# EasyEDA Pro project CALU_BMS_1_2_0_0.epro, schematic Slave BMS

## Sheets
1 P1: Board Name: Slave; Create Date: 2025-08-16; Page Name: P1; Project Name: CALU_BMS; Schematic Name: Slave BMS; Update Date: 2025-09-30; Company: EasyEDA.com; Page Size: A4; Version: V1.0
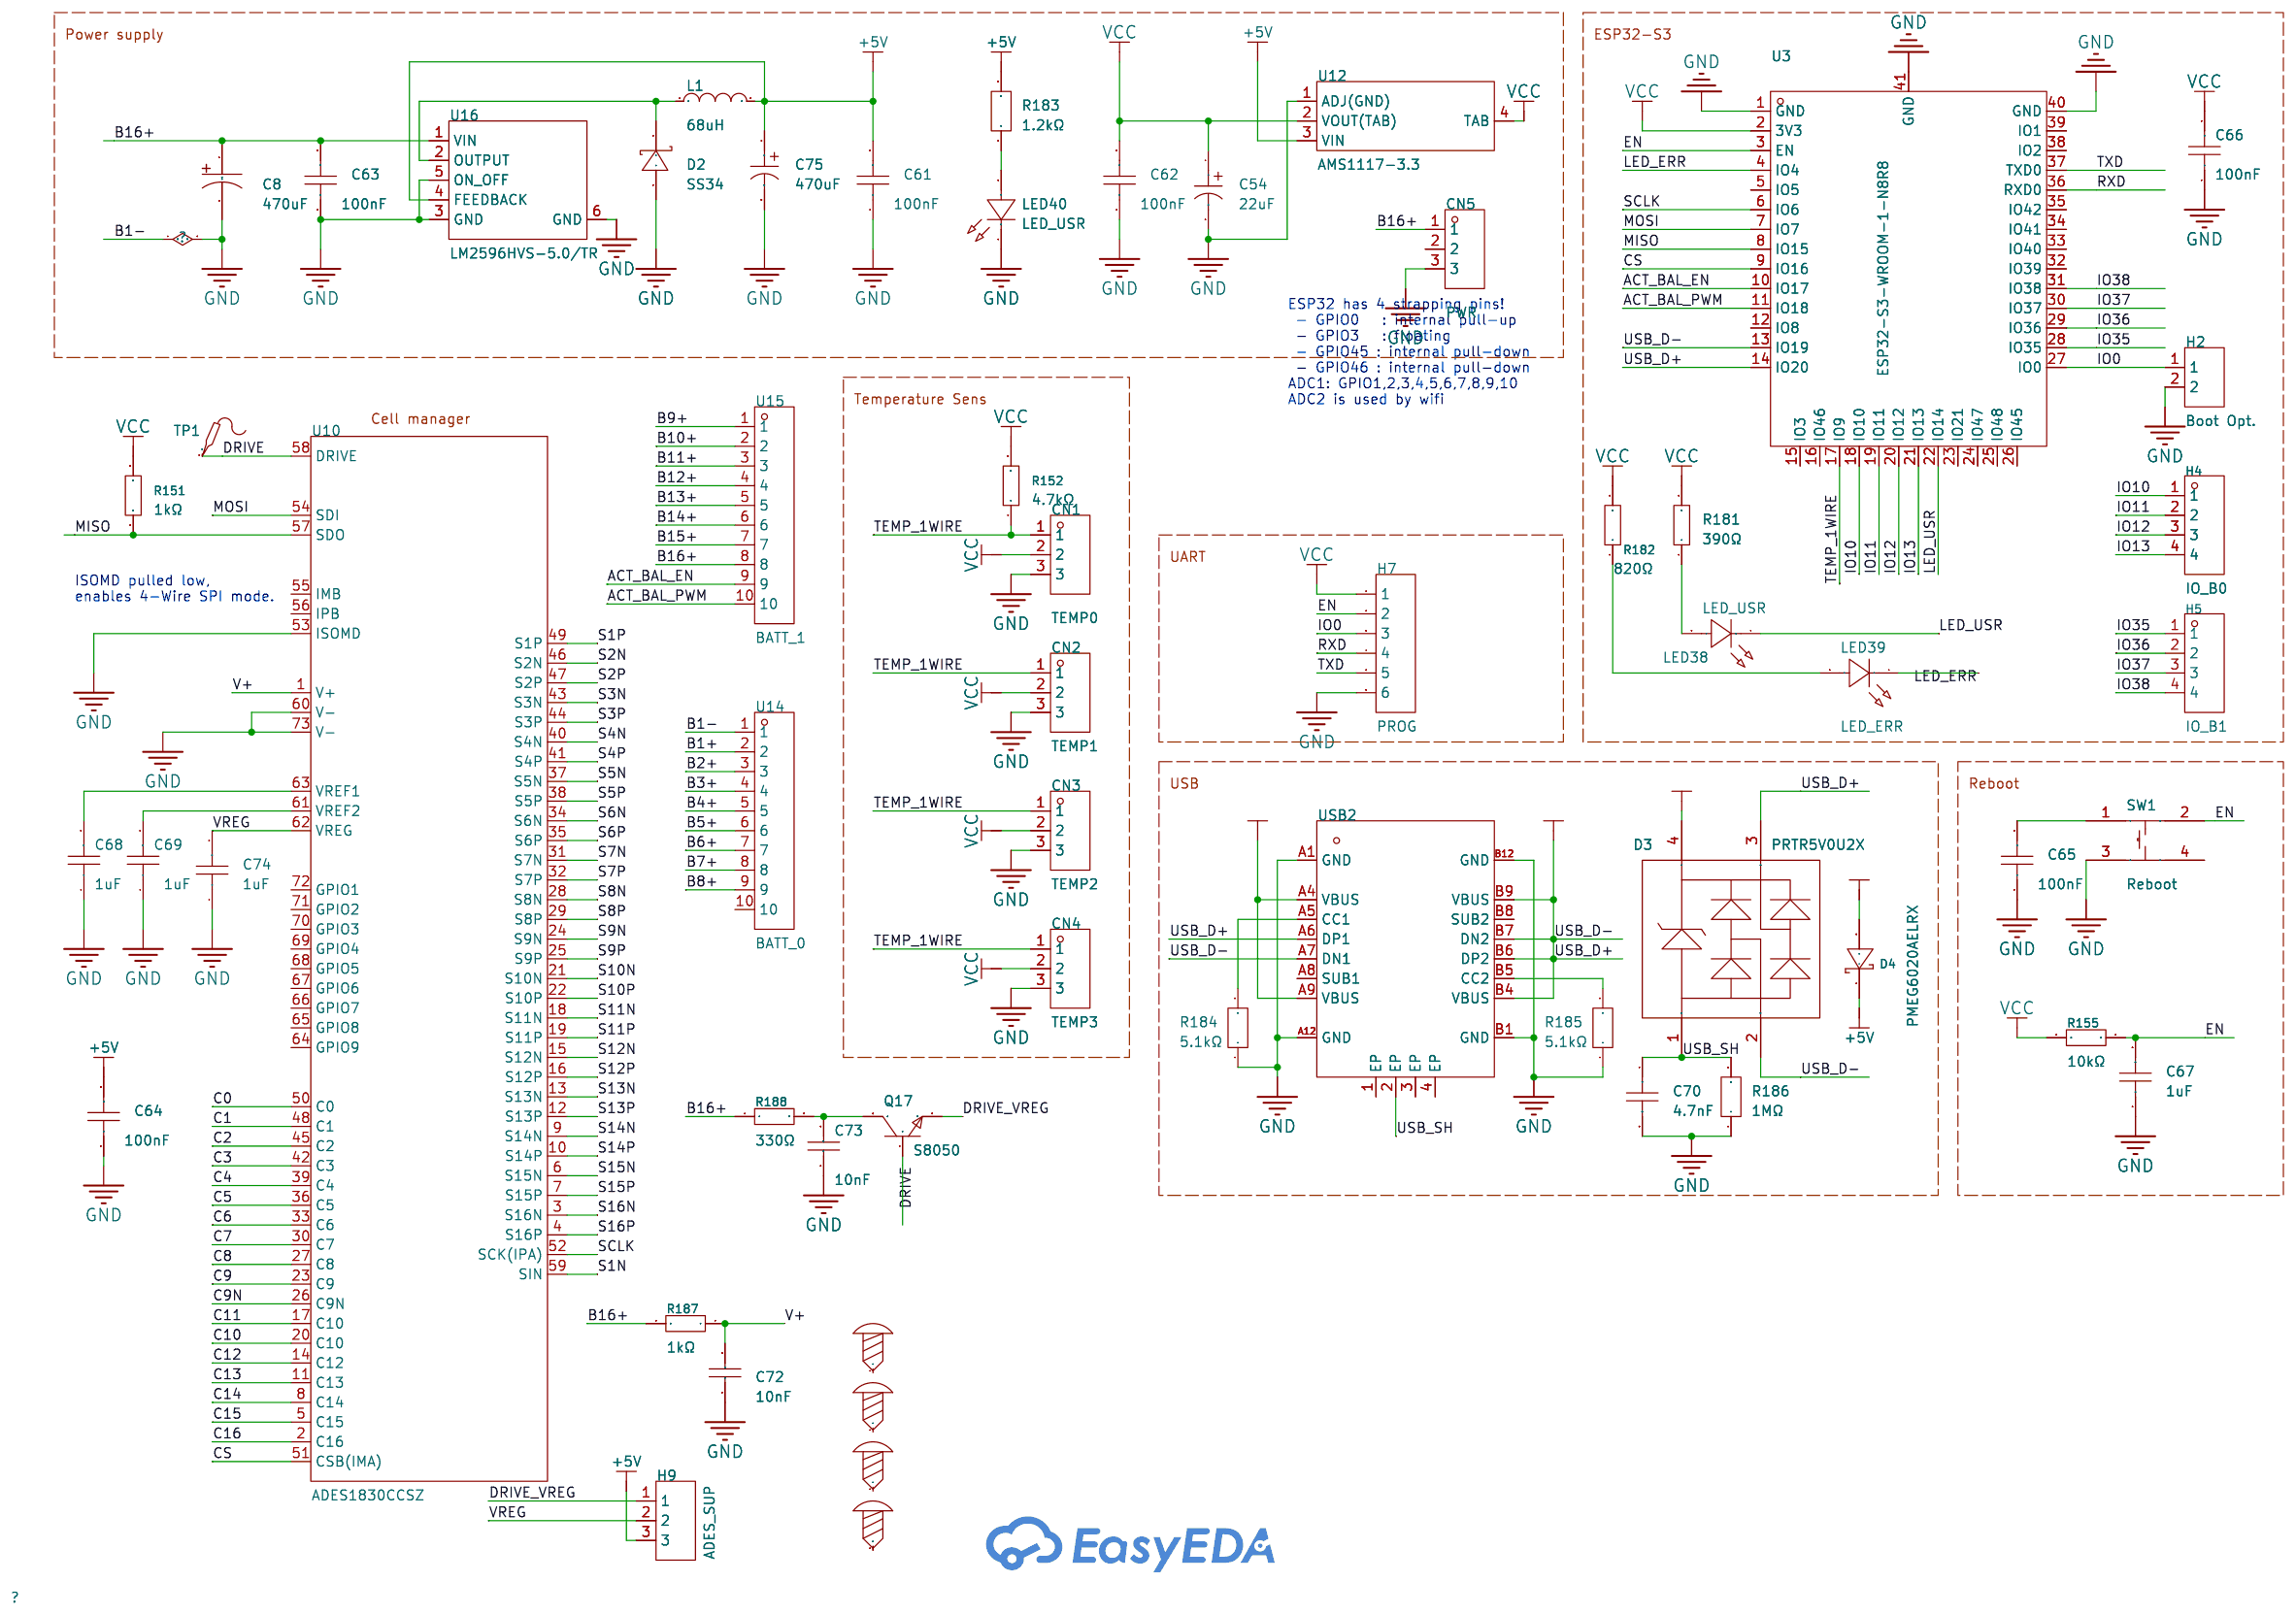
[diagram p1: P1]
2 P2: Create Date: 2025-08-28; Page Name: P2; Project Name: Active Balancer splitter; Schematic Name: Schematic2; Update Date: 2025-09-05
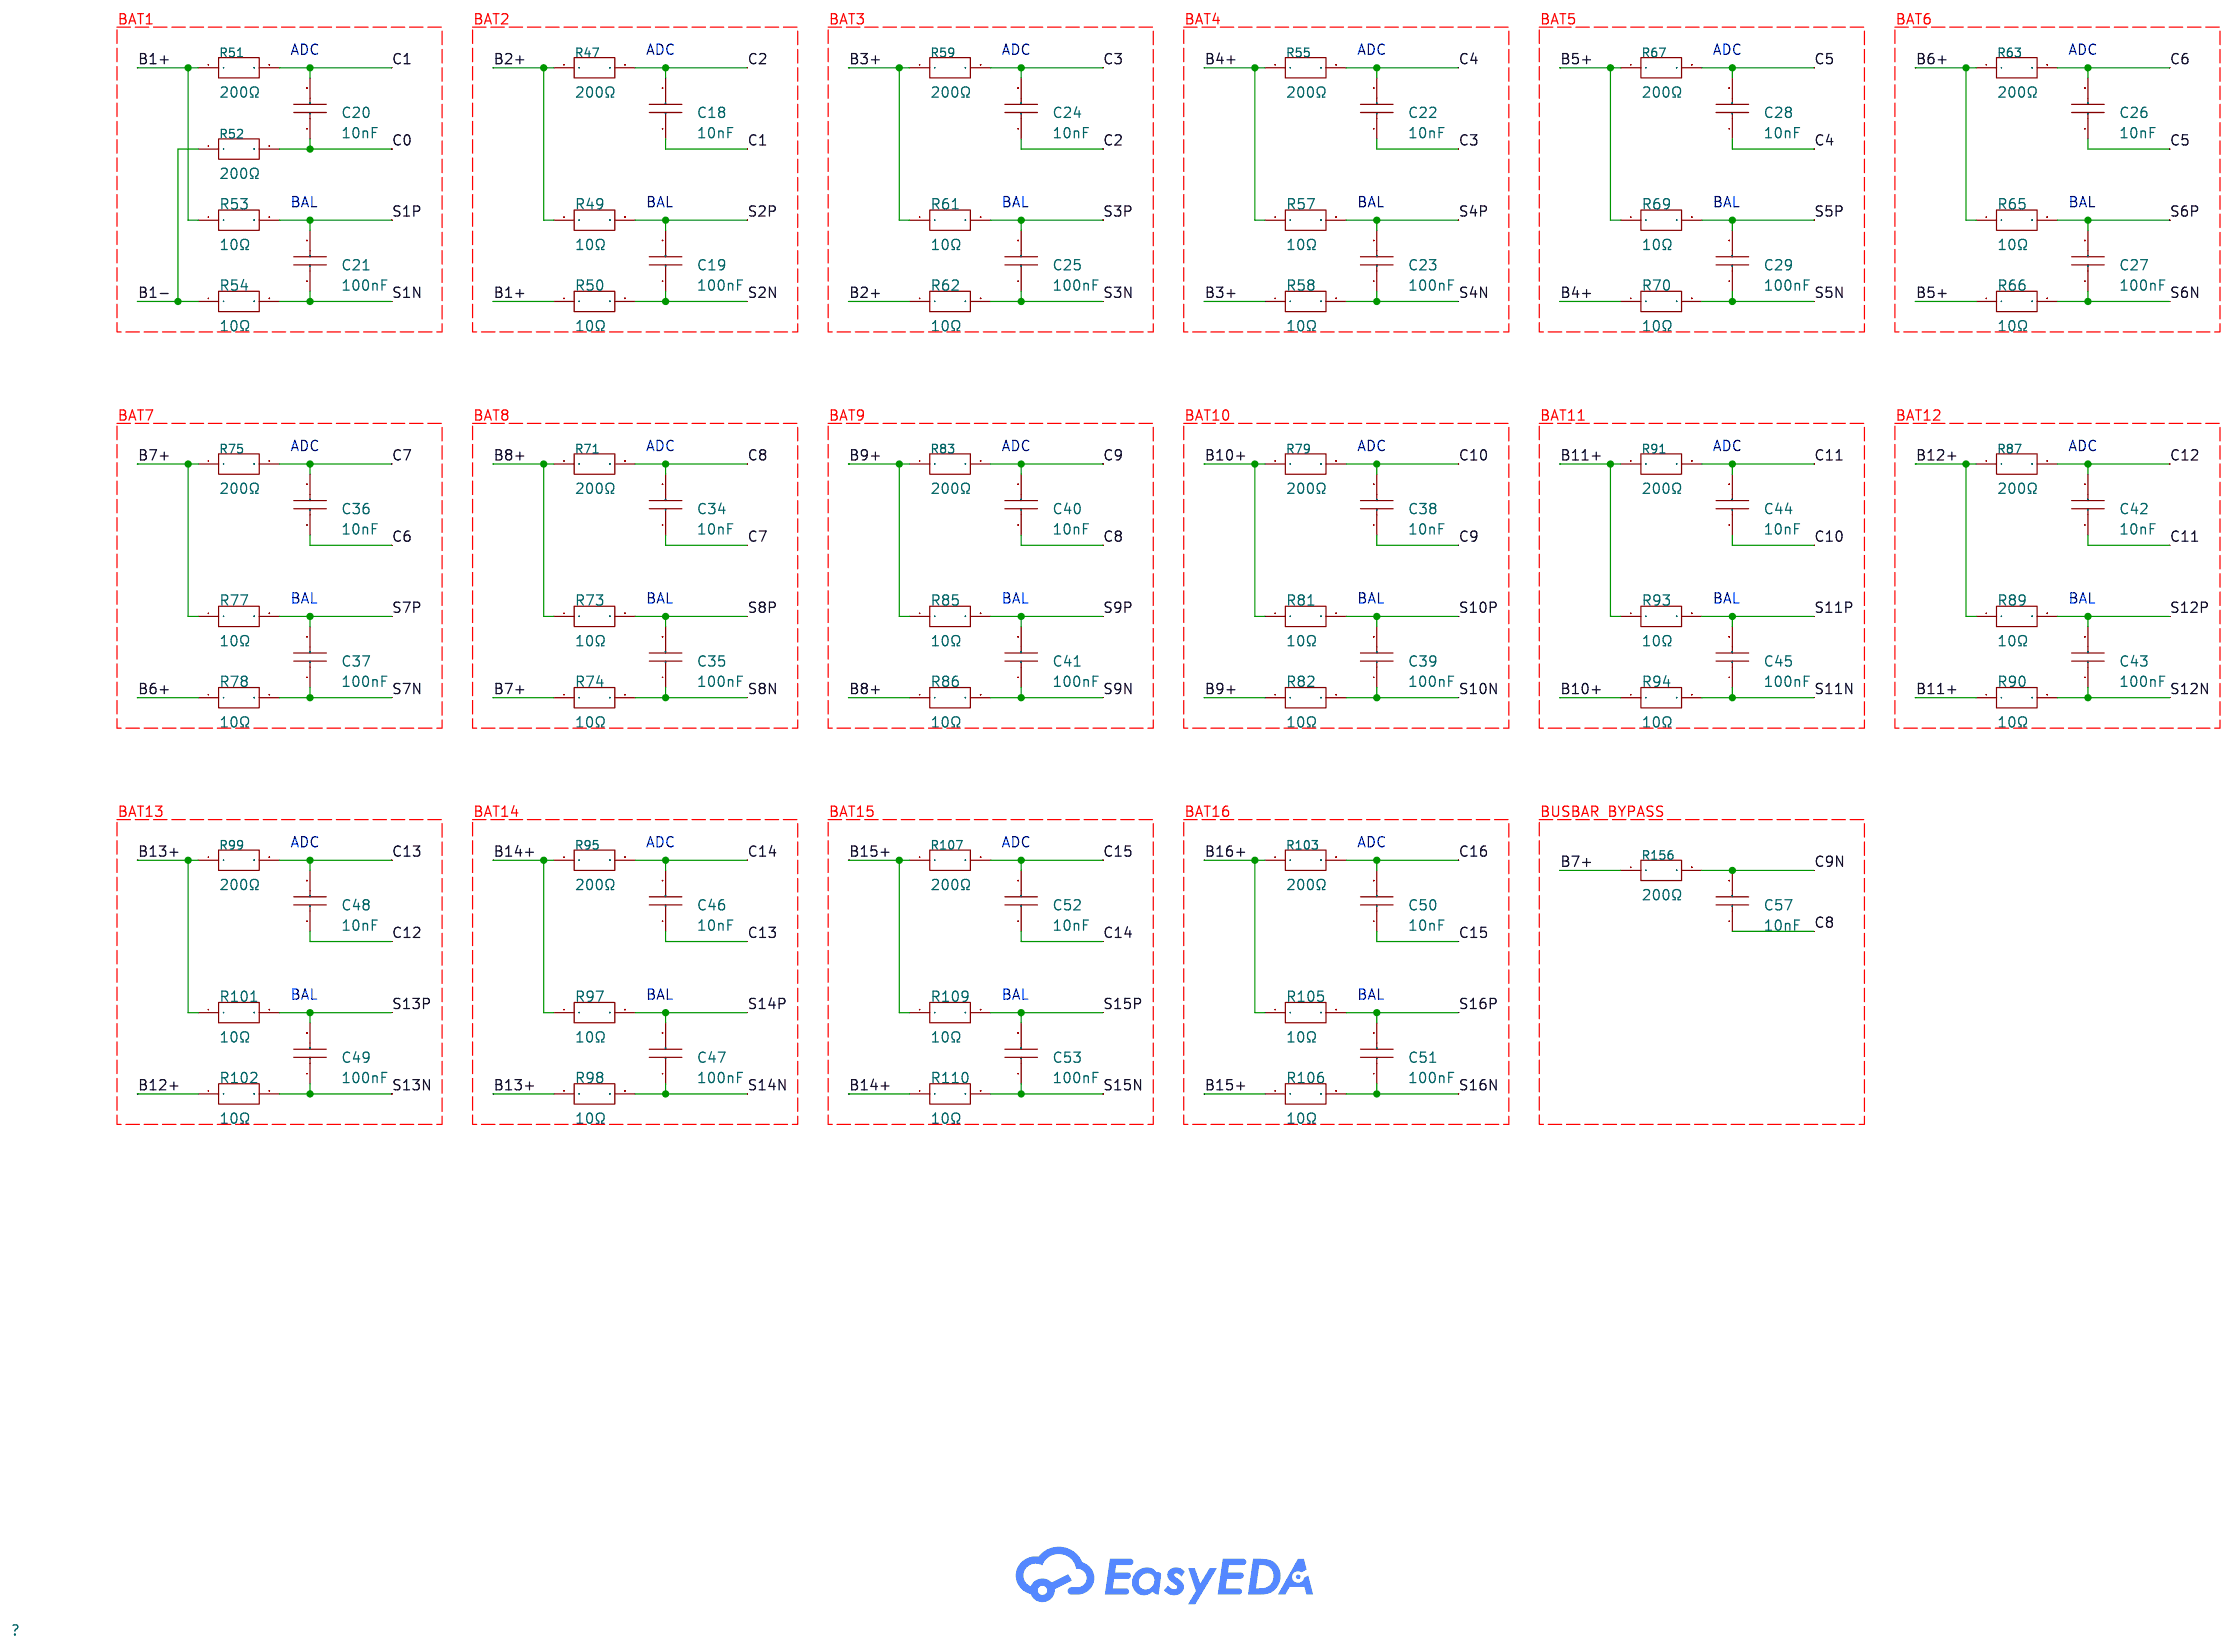
[diagram p2: P2]
3 P3: Board Name: Board2; Create Date: 2025-09-02; Page Name: P3; Project Name: Active Balancer splitter; Schematic Name: Schematic2; Update Date: 2025-09-02
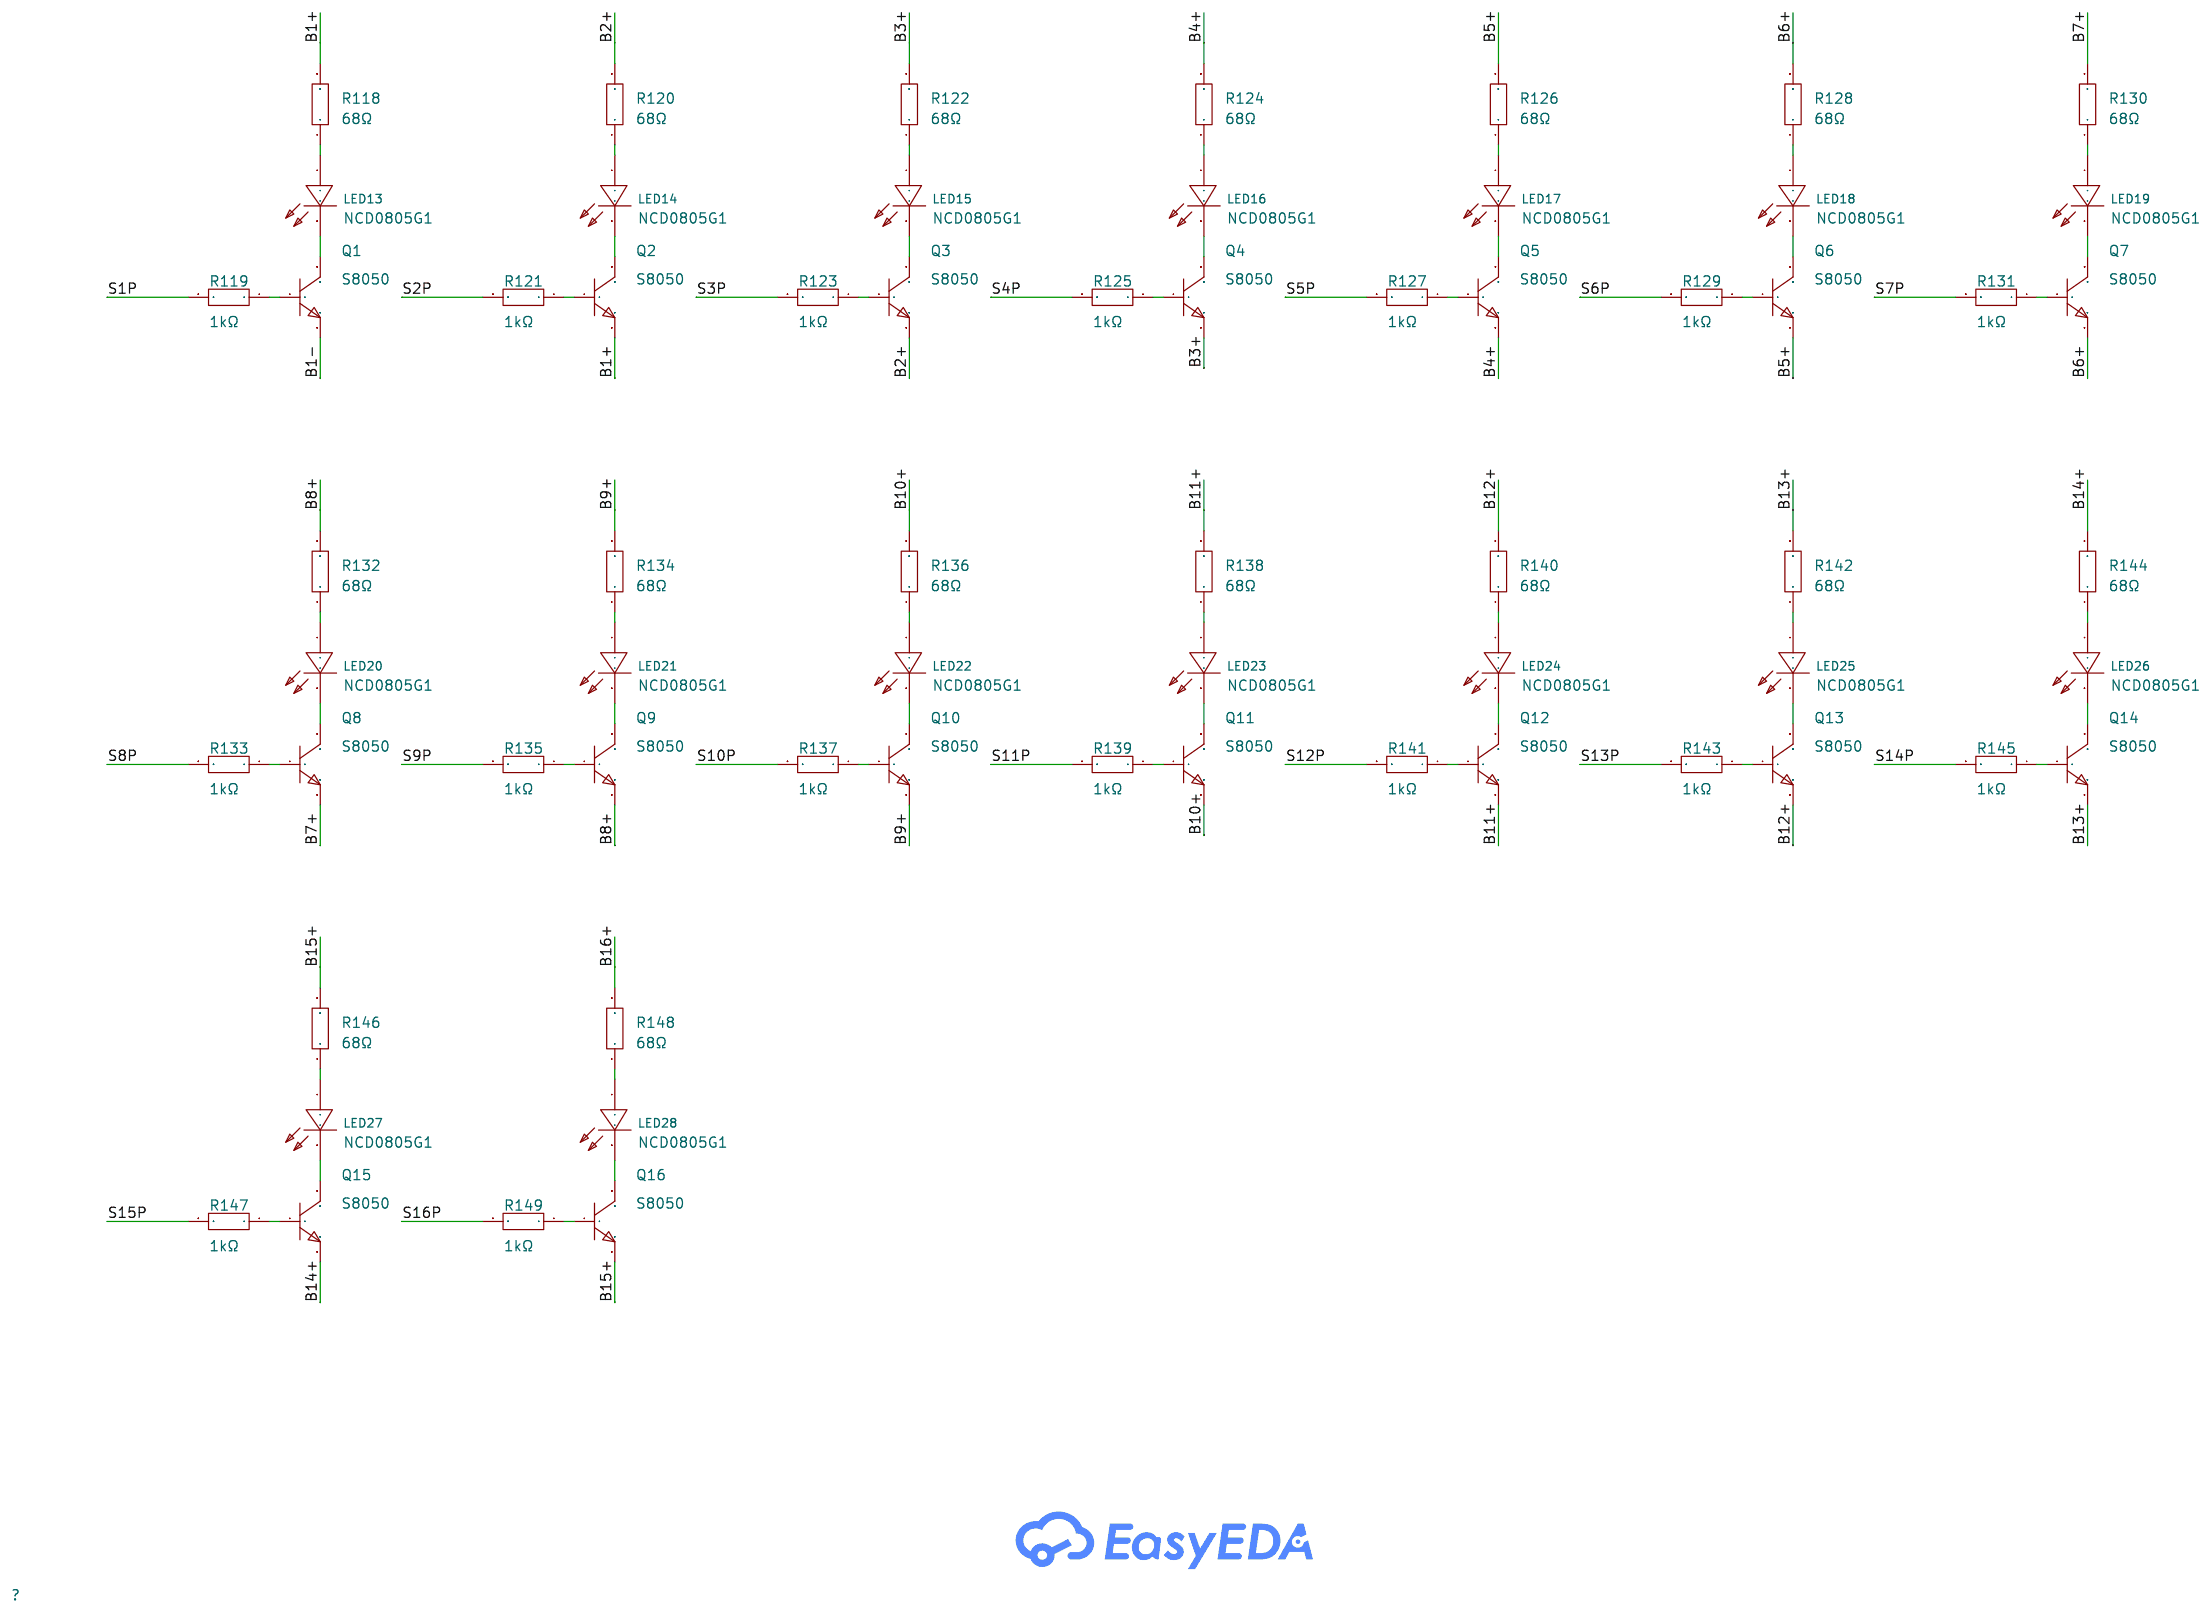
[diagram p3: P3]

## Parts
sheet P1
C8  470uF  [CAP-SMD_BD16.0-L17.0-W17.0-FD-LS18.0]
C54  22uF  [CAP-SMD_BD5.0-L5.3-W5.3-LS6.0-FD]
C61  100nF  [C0603]
C62  100nF  [C0603]
C63  100nF  [C0603]
C64  100nF  [C0603]
C65  100nF  [C0603]
C66  100nF  [C0603]
C67  1uF  [C0603]
C68  1uF  [C0603]
C69  1uF  [C0603]
C70  4.7nF  [C0603]
C72  10nF  [C0603]
C73  10nF  [C0603]
C74  1uF  [C0603]
C75  470uF  [CAP-SMD_BD6.3-L6.6-W6.6-LS7.6-RD]
CN1  TEMP0  [CONN-TH_3P-P3.50_MAX_MX15EDGRM-3.5-GN01-03P-CU-A]
CN2  TEMP1  [CONN-TH_3P-P3.50_MAX_MX15EDGRM-3.5-GN01-03P-CU-A]
CN3  TEMP2  [CONN-TH_3P-P3.50_MAX_MX15EDGRM-3.5-GN01-03P-CU-A]
CN4  TEMP3  [CONN-TH_3P-P3.50_MAX_MX15EDGRM-3.5-GN01-03P-CU-A]
CN5  PWR  [CONN-TH_3P-P3.50_MAX_MX15EDGRM-3.5-GN01-03P-CU-A]
D2  SS34  [SMA_L4.3-W2.6-LS5.2-RD]
D3  PRTR5V0U2X  [SOT-143_L2.9-W1.3-P1.92-LS2.3-BL]
D4  PMEG6020AELRX  [SOD-123_L2.6-W1.7-LS3.5-RD]
H2  Boot Opt.  [HDR-TH_2P-P2.54-V-M]
H4  IO_B0  [HDR-TH_4P-P2.54-V-M]
H5  IO_B1  [HDR-TH_4P-P2.54-V-M]
H7  PROG  [HDR-TH_6P-P2.54-V-M-1]
H9  ADES_SUP  [HDR-TH_3P-P2.54-V-M]
L1  68uH  [IND-SMD_L12.5-W12.5]
LED38  LED_USR  [LED0603-RD-YELLOW]
LED39  LED_ERR  [LED0603-RD_RED]
LED40  LED_USR  [LED0603-RD-YELLOW]
Q17  S8050  [SOT-23-3_L2.9-W1.6-P1.90-LS2.8-BR]
R151  1kΩ  [R0603]
R152  4.7kΩ  [R0603]
R155  10kΩ  [R0603]
R181  390Ω  [R0603]
R182  820Ω  [R0603]
R183  1.2kΩ  [R0603]
R184  5.1kΩ  [R0603]
R185  5.1kΩ  [R0603]
R186  1MΩ  [R0603]
R187  1kΩ  [R0603]
R188  330Ω  [R0603]
SCREW1  -  [Screw-Hole-M4]
SCREW2  -  [Screw-Hole-M4]
SCREW3  -  [Screw-Hole-M4]
SCREW4  -  [Screw-Hole-M4]
SW1  Reboot  [SW-SMD_4P-L6.0-W6.0-P4.50-LS9.0-H2.5]
TP1  -  [Test-Point-0.5mm]
U3  ESP32-S3-WROOM-1-N8R8  [WIRELM-SMD_ESP32-S3-WROOM-1]
U10  ADES1830CCSZ  [LFCSP-72_L10.0-W10.0-P0.50-BL-EP7.3]
U12  AMS1117-3.3  [SOT-223-4_L6.5-W3.5-P2.30-LS7.0-BR]
U14  BATT_0  [CONN-TH_10P-P3.50_MX15EDGRM-3.5-10P-GN01-CU-A]
U15  BATT_1  [CONN-TH_10P-P3.50_MX15EDGRM-3.5-10P-GN01-CU-A]
U16  LM2596HVS-5.0/TR  [TO-263-5_L10.2-W8.9-P1.70-LS15.2-BR]
USB2  -  [USB-C-SMD_KH-TYPE-C-16P]
sheet P2
C18  10nF  [C0603]
C19  100nF  [C0603]
C20  10nF  [C0603]
C21  100nF  [C0603]
C22  10nF  [C0603]
C23  100nF  [C0603]
C24  10nF  [C0603]
C25  100nF  [C0603]
C26  10nF  [C0603]
C27  100nF  [C0603]
C28  10nF  [C0603]
C29  100nF  [C0603]
C34  10nF  [C0603]
C35  100nF  [C0603]
C36  10nF  [C0603]
C37  100nF  [C0603]
C38  10nF  [C0603]
C39  100nF  [C0603]
C40  10nF  [C0603]
C41  100nF  [C0603]
C42  10nF  [C0603]
C43  100nF  [C0603]
C44  10nF  [C0603]
C45  100nF  [C0603]
C46  10nF  [C0603]
C47  100nF  [C0603]
C48  10nF  [C0603]
C49  100nF  [C0603]
C50  10nF  [C0603]
C51  100nF  [C0603]
C52  10nF  [C0603]
C53  100nF  [C0603]
C57  10nF  [C0603]
R47  200Ω  [R0603]
R49  10Ω  [R2512]
R50  10Ω  [R2512]
R51  200Ω  [R0603]
R52  200Ω  [R0603]
R53  10Ω  [R2512]
R54  10Ω  [R2512]
R55  200Ω  [R0603]
R57  10Ω  [R2512]
R58  10Ω  [R2512]
R59  200Ω  [R0603]
R61  10Ω  [R2512]
R62  10Ω  [R2512]
R63  200Ω  [R0603]
R65  10Ω  [R2512]
R66  10Ω  [R2512]
R67  200Ω  [R0603]
R69  10Ω  [R2512]
R70  10Ω  [R2512]
R71  200Ω  [R0603]
R73  10Ω  [R2512]
R74  10Ω  [R2512]
R75  200Ω  [R0603]
R77  10Ω  [R2512]
R78  10Ω  [R2512]
R79  200Ω  [R0603]
R81  10Ω  [R2512]
R82  10Ω  [R2512]
R83  200Ω  [R0603]
R85  10Ω  [R2512]
R86  10Ω  [R2512]
R87  200Ω  [R0603]
R89  10Ω  [R2512]
R90  10Ω  [R2512]
R91  200Ω  [R0603]
R93  10Ω  [R2512]
R94  10Ω  [R2512]
R95  200Ω  [R0603]
R97  10Ω  [R2512]
R98  10Ω  [R2512]
R99  200Ω  [R0603]
R101  10Ω  [R2512]
R102  10Ω  [R2512]
R103  200Ω  [R0603]
R105  10Ω  [R2512]
R106  10Ω  [R2512]
R107  200Ω  [R0603]
R109  10Ω  [R2512]
R110  10Ω  [R2512]
R156  200Ω  [R0603]
sheet P3
LED13  NCD0805G1  [LED0805-R-RD]
LED14  NCD0805G1  [LED0805-R-RD]
LED15  NCD0805G1  [LED0805-R-RD]
LED16  NCD0805G1  [LED0805-R-RD]
LED17  NCD0805G1  [LED0805-R-RD]
LED18  NCD0805G1  [LED0805-R-RD]
LED19  NCD0805G1  [LED0805-R-RD]
LED20  NCD0805G1  [LED0805-R-RD]
LED21  NCD0805G1  [LED0805-R-RD]
LED22  NCD0805G1  [LED0805-R-RD]
LED23  NCD0805G1  [LED0805-R-RD]
LED24  NCD0805G1  [LED0805-R-RD]
LED25  NCD0805G1  [LED0805-R-RD]
LED26  NCD0805G1  [LED0805-R-RD]
LED27  NCD0805G1  [LED0805-R-RD]
LED28  NCD0805G1  [LED0805-R-RD]
Q1  S8050  [SOT-23-3_L2.9-W1.6-P1.90-LS2.8-BR]
Q2  S8050  [SOT-23-3_L2.9-W1.6-P1.90-LS2.8-BR]
Q3  S8050  [SOT-23-3_L2.9-W1.6-P1.90-LS2.8-BR]
Q4  S8050  [SOT-23-3_L2.9-W1.6-P1.90-LS2.8-BR]
Q5  S8050  [SOT-23-3_L2.9-W1.6-P1.90-LS2.8-BR]
Q6  S8050  [SOT-23-3_L2.9-W1.6-P1.90-LS2.8-BR]
Q7  S8050  [SOT-23-3_L2.9-W1.6-P1.90-LS2.8-BR]
Q8  S8050  [SOT-23-3_L2.9-W1.6-P1.90-LS2.8-BR]
Q9  S8050  [SOT-23-3_L2.9-W1.6-P1.90-LS2.8-BR]
Q10  S8050  [SOT-23-3_L2.9-W1.6-P1.90-LS2.8-BR]
Q11  S8050  [SOT-23-3_L2.9-W1.6-P1.90-LS2.8-BR]
Q12  S8050  [SOT-23-3_L2.9-W1.6-P1.90-LS2.8-BR]
Q13  S8050  [SOT-23-3_L2.9-W1.6-P1.90-LS2.8-BR]
Q14  S8050  [SOT-23-3_L2.9-W1.6-P1.90-LS2.8-BR]
Q15  S8050  [SOT-23-3_L2.9-W1.6-P1.90-LS2.8-BR]
Q16  S8050  [SOT-23-3_L2.9-W1.6-P1.90-LS2.8-BR]
R118  68Ω  [R0603]
R119  1kΩ  [R0603]
R120  68Ω  [R0603]
R121  1kΩ  [R0603]
R122  68Ω  [R0603]
R123  1kΩ  [R0603]
R124  68Ω  [R0603]
R125  1kΩ  [R0603]
R126  68Ω  [R0603]
R127  1kΩ  [R0603]
R128  68Ω  [R0603]
R129  1kΩ  [R0603]
R130  68Ω  [R0603]
R131  1kΩ  [R0603]
R132  68Ω  [R0603]
R133  1kΩ  [R0603]
R134  68Ω  [R0603]
R135  1kΩ  [R0603]
R136  68Ω  [R0603]
R137  1kΩ  [R0603]
R138  68Ω  [R0603]
R139  1kΩ  [R0603]
R140  68Ω  [R0603]
R141  1kΩ  [R0603]
R142  68Ω  [R0603]
R143  1kΩ  [R0603]
R144  68Ω  [R0603]
R145  1kΩ  [R0603]
R146  68Ω  [R0603]
R147  1kΩ  [R0603]
R148  68Ω  [R0603]
R149  1kΩ  [R0603]

## Library data of the parts
C8 = VZH471M1JTR-1616: Capacitance:470uF Tolerance:±20% Tolerance:±20% Voltage Rating:63V Ripple Current:- Equivalent Series Resistance(ESR):- Diameter:16mm Height - Seated (Max):16.5mm Lifetime:5000hrs@105℃ Operating Temperature:-45℃~+105℃ Operating Temperature:-45℃~+105℃; LCSC Part Name: 470uF ±20% 63V; Supplier Part: C249935; Manufacturer: Lelon(立隆); Supplier Footprint: SMD,D16xL16.5mm; JLCPCB Part Class: Extended Part; Datasheet: https://atta.szlcsc.com/upload/public/pdf/source/20181115/C249956_178B4AAE514BBF17AF6A9453F96D6C96.pdf; Supplier: LCSC; Tolerance: ±20%; Voltage Rating: 63V; Diameter: 16mm; Height - Seated (Max): 16.5mm; Lifetime: 5000hrs@105℃; Operating Temperature: -45℃~+105℃
C54 = CS1E220M-CRD54_C3001207: Capacitance:22uF Tolerance:±20% Tolerance:±20% Voltage Rating:25V Ripple Current:25mA@120Hz Diameter:5mm Height - Seated (Max):5.4mm Lifetime:2000hrs@105℃ Operating Temperature:-40℃~+105℃ Operating Temperature:-40℃~+105℃; LCSC Part Name: 22uF ±20% 25V; Supplier Part: C3001207; Manufacturer: ROQANG(容强); Manufacturer Part: CS1E220M-CRD54; Supplier Footprint: SMD,D5xL5.4mm; JLCPCB Part Class: Extended Part; Datasheet: https://item.szlcsc.com/datasheet/CS1E220M-CRD54/3483887.html; Supplier: LCSC; Tolerance: ±20%; Voltage Rating: 25V; Ripple Current: 25mA@120Hz; Diameter: 5mm; Height - Seated (Max): 5.4mm; Lifetime: 2000hrs@105℃; Operating Temperature: -40℃~+105℃
C19 C21 C23 C25 C27 C29 C35 C37 C39 C41 C43 C45 C47 C49 C51 C53 C61-C66 = CC0603KRX7R9BB104: Capacitance:100nF Tolerance:±10% Tolerance:±10% Voltage Rating:50V Temperature Coefficient:X7R; LCSC Part Name: 100nF ±10% 50V; Supplier Part: C14663; Manufacturer: YAGEO(国巨); Supplier Footprint: 0603; JLCPCB Part Class: Basic Part; Datasheet: https://item.szlcsc.com/datasheet/CC0603KRX7R9BB104/15331.html; Supplier: LCSC; Tolerance: ±10%; Voltage Rating: 50V; Temperature Coefficient: X7R
C67-C69 C74 = CL10A105KB8NNNC: Capacitance:1uF Tolerance:±10% Tolerance:±10% Voltage Rating:50V Temperature Coefficient:X5R; LCSC Part Name: 1uF ±10% 50V; Supplier Part: C15849; Manufacturer: SAMSUNG(三星); Supplier Footprint: 0603; JLCPCB Part Class: Basic Part; Datasheet: https://item.szlcsc.com/datasheet/CL10A105KB8NNNC/16531.html; Supplier: LCSC; Tolerance: ±10%; Voltage Rating: 50V; Temperature Coefficient: X5R
C70 = CAP_0603: Supplier Footprint: 0603
C18 C20 C22 C24 C26 C28 C34 C36 C38 C40 C42 C44 C46 C48 C50 C52 C57 C72 C73 = CC0603KRX7R9BB103: Capacitance:10nF Tolerance:±10% Tolerance:±10% Voltage Rating:50V Temperature Coefficient:X7R; LCSC Part Name: 10nF ±10% 50V; Supplier Part: C100042; Manufacturer: YAGEO(国巨); Supplier Footprint: 0603; JLCPCB Part Class: Extended Part; Datasheet: https://item.szlcsc.com/datasheet/CC0603KRX7R9BB103/101256.html; Supplier: LCSC; Tolerance: ±10%; Voltage Rating: 50V; Temperature Coefficient: X7R
C75 = RVT1C471M0607: Capacitance:470uF Tolerance:±20% Tolerance:±20% Voltage Rating:16V Ripple Current:185mA@120Hz Diameter:6.3mm Height - Seated (Max):7.7mm Lifetime:2000hrs@105℃ Operating Temperature:-40℃~+105℃ Operating Temperature:-40℃~+105℃; LCSC Part Name: 470uF ±20% 16V; Supplier Part: C2977552; Manufacturer: ROQANG(容强); Supplier Footprint: SMD,D6.3xL7.7mm; JLCPCB Part Class: Extended Part; Datasheet: https://item.szlcsc.com/datasheet/RVT1C471M0607/3388608.html; Supplier: LCSC; Tolerance: ±20%; Voltage Rating: 16V; Ripple Current: 185mA@120Hz; Diameter: 6.3mm; Height - Seated (Max): 7.7mm; Lifetime: 2000hrs@105℃; Operating Temperature: -40℃~+105℃
CN1-CN5 = MX15EDGRM-3.5-03P-GN01-Cu-A: Connector Type:Board Side/Socket - Closed Termination Style:Screw Number of Positions or Pins:1x3P Pitch:3.5mm Color:Green Mounting Type:Right-Angle Pin Number of Pins:3P Number of Rows:1 Number of PINs Per Row:3 Current Rating:8A Voltage Rating (Max):300; LCSC Part Name: 螺丝固定 1x3P 3.5mm 排数:1 每排P数:3; Supplier Part: C5188342; Manufacturer: MAX(迈旭); Supplier Footprint: 弯插,P=3.5mm; JLCPCB Part Class: Extended Part; Datasheet: https://item.szlcsc.com/datasheet/MX15EDGRM-3.5-03P-GN01-Cu-A/5862426.html; Supplier: LCSC; Connector Type: Board Side/Socket - Closed; Termination Style: Screw; Number of Positions or Pins: 1x3P; Pitch: 3.5mm; Color: Green; Mounting Type: Right-Angle Pin; Number of Pins: 3P; Number of Rows: 1; Number of PINs Per Row: 3; Current Rating: 8A; Voltage Rating (Max): 300V; Operating Temperature: -40℃~+105℃
D2 = SS34_C8678: Diode Configuration:Independent Voltage - Forward(Vf@If):550mV@3A Voltage - DC Reverse(Vr):40V Current - Rectified:3A Reverse Leakage Current (Ir):500uA@40V Operating Junction Temperature Range:-55℃~+125℃ Operating Junction Temperature Range:-55℃~+125℃; LCSC Part Name: 电压:40V 电流:3A; Supplier Part: C8678; Manufacturer: MDD(辰达半导体); Supplier Footprint: SMA(DO-214AC); JLCPCB Part Class: Basic Part; Datasheet: https://item.szlcsc.com/datasheet/SS34/9178.html; Supplier: LCSC; Diode Configuration: Independent; Voltage - Forward(Vf@If): 550mV@3A; Voltage - DC Reverse(Vr): 40V; Current - Rectified: 3A; Reverse Leakage Current (Ir): 500uA@40V; Operating Junction Temperature Range: -55℃~+125℃
D3 = PRTR5V0U2X_C21713980: Polarity:Unidirectional Reverse Stand-Off Voltage (Vrwm):5V Clamping Voltage:18V Peak Pulse Current (Ipp):4A Peak Pulse Power Dissipation (Ppp):60W Voltage - Breakdown:6V Reverse Leakage Current (Ir):500nA Number of Channels:Dual channel Operating Tempera; LCSC Part Name: 丝印WR1 单向 5V截止 4A峰值脉冲; Supplier Part: C21713980; Manufacturer: GOODWORK(固得沃克); Supplier Footprint: SOT-143; JLCPCB Part Class: Extended Part; Datasheet: https://item.szlcsc.com/datasheet/PRTR5V0U2X/23140173.html; Supplier: LCSC; Polarity: Unidirectional; Reverse Stand-Off Voltage (Vrwm): 5V; Clamping Voltage: 18V; Peak Pulse Current (Ipp): 4A; Peak Pulse Power Dissipation (Ppp): 60W; Voltage - Breakdown: 6V; Reverse Leakage Current (Ir): 500nA; Number of Channels: Dual channel; Operating Temperature: -55℃~+125℃; Type: TVS
D4 = PMEG6020AELRX: Forward Voltage (Vf@If):670mV@2A Reverse Voltage (Vr):60V Average Rectified Current (Io):2A Reverse Leakage Current (Ir):700nA@60V; LCSC Part Name: 电压:60V 电流:2A; Supplier Part: C552938; Manufacturer: Nexperia(安世); Supplier Footprint: SOD-123W; JLCPCB Part Class: Extended Part; Datasheet: https://atta.szlcsc.com/upload/public/pdf/source/20200610/C552938_B8C7D9A5A76F9EEA08B29DEA3727CBD6.pdf; Supplier: LCSC; Forward Voltage (Vf@If): 670mV@2A; Reverse Voltage (Vr): 60V; Average Rectified Current (Io): 2A; Reverse Leakage Current (Ir): 700nA@60V
H2 = PZ254V-11-02P: Pin Structure:1x2P Pitch:2.54mm Row Spacing:- Circluar Pins/Square Pins:Pin Header Mounting Type:Through Hole Number of Rows:1 Number of Pins:2P Current Rating:- Voltage Rating (Max):- Length of Mating Pin:6mm Insulation Height:2.5mm Length of End Connect; LCSC Part Name: 1x2P 间距:2.54mm 方针 直插; Supplier Part: C492401; Manufacturer: XFCN(兴飞); Supplier Footprint: 插件,P=2.54mm; JLCPCB Part Class: Extended Part; Datasheet: https://item.szlcsc.com/datasheet/PZ254V-11-02P/502957.html; Supplier: LCSC; Pin Structure: 1x2P; Pitch: 2.54mm; Circluar Pins/Square Pins: Pin Header; Mounting Type: Through Hole; Number of Rows: 1; Number of Pins: 2P; Length of Mating Pin: 6mm; Insulation Height: 2.5mm; Length of End Connection Pin: 3mm; Contact Material: Brass; Operating Temperature: -40℃~+105℃; Color: Black
H4 H5 = PZ254V-11-04P: Pin Structure:1x4P Pitch:2.54mm Row Spacing:- Circluar Pins/Square Pins:Pin Header Mounting Type:Through Hole Number of Rows:1 Number of Pins:4P Current Rating:3A Voltage Rating (Max):250V Length of Mating Pin:6mm Insulation Height:2.5mm Length of End Con; LCSC Part Name: 1x4P 间距:2.54mm 方针 直插; Supplier Part: C2691448; Manufacturer: XFCN(兴飞); Supplier Footprint: 插件,P=2.54mm; JLCPCB Part Class: Extended Part; Datasheet: https://item.szlcsc.com/datasheet/PZ254V-11-04P/2801085.html; Supplier: LCSC; Pin Structure: 1x4P; Pitch: 2.54mm; Circluar Pins/Square Pins: Pin Header; Mounting Type: Through Hole; Number of Rows: 1; Number of Pins: 4P; Current Rating: 3A; Voltage Rating (Max): 250V; Length of Mating Pin: 6mm; Insulation Height: 2.5mm; Length of End Connection Pin: 3mm; Operating Temperature: -40℃~+105℃; Color: Black
H7 = 2.54-1x6P直针: Pin Structure:1x6P Pitch:2.54mm Row Spacing:- Circluar Pins/Square Pins:Policy Mounting Type:Straight Number of Rows:Single Row Number of Pins:6P Current Rating:3A Voltage Rating (Max):- Length of Mating Pin:- Insulation Height:- Contact Material:Brass Co; LCSC Part Name: 1x6P 间距:2.54mm 方针 直插; Supplier Part: C37208; Manufacturer: BOOMELE(博穆精密); Supplier Footprint: 插件,P=2.54mm; JLCPCB Part Class: Extended Part; Datasheet: https://atta.szlcsc.com/upload/public/pdf/source/20250115/42A019761A40C8B839643401D8CA5A96.pdf; Supplier: LCSC; Pin Structure: 1x6P; Pitch: 2.54mm; Circluar Pins/Square Pins: Policy; Mounting Type: Straight; Number of Rows: Single Row; Number of Pins: 6P; Current Rating: 3A; Contact Material: Brass; Operating Temperature: -40℃~+105℃; Color: Black
H9 = PZ254V-11-03P: Pin Structure:1x3P Pitch:2.54mm Row Spacing:- Circluar Pins/Square Pins:Pin Header Mounting Type:Through Hole Number of Rows:1 Number of Pins:3P Current Rating:3A Voltage Rating (Max):250V Length of Mating Pin:6mm Insulation Height:2.5mm Length of End Con; LCSC Part Name: 1x3P 间距:2.54mm 方针 直插; Supplier Part: C2937625; Manufacturer: XFCN(兴飞); Supplier Footprint: 插件,P=2.54mm; JLCPCB Part Class: Extended Part; Datasheet: https://item.szlcsc.com/datasheet/PZ254V-11-03P/3293280.html; Supplier: LCSC; Pin Structure: 1x3P; Pitch: 2.54mm; Circluar Pins/Square Pins: Pin Header; Mounting Type: Through Hole; Number of Rows: 1; Number of Pins: 3P; Current Rating: 3A; Voltage Rating (Max): 250V; Length of Mating Pin: 6mm; Insulation Height: 2.5mm; Length of End Connection Pin: 3mm; Operating Temperature: -40℃~+105℃; Color: Black
L1 = CYH125-68UH: Inductance: Tolerance:±20% Tolerance:±20% Rated Current: DC Resistance (DCR):64.8mΩ; LCSC Part Name: 68uH ±20%; Supplier Part: C7431083; Manufacturer: SHOU HAN(首韩); Supplier Footprint: SMD,12.5x12.5mm; JLCPCB Part Class: Extended Part; Datasheet: https://atta.szlcsc.com/upload/public/pdf/source/20230621/00B923FD072A2FA4420B8D9BC7718C72.pdf; Supplier: LCSC; Tolerance: ±20%; DC Resistance (DCR): 64.8mΩ
LED38 LED40 = APTD1608LZGCK: Illumination Color:Emerald Green Voltage - Forward(Vf):2.65V Voltage - Forward(Vf):2.65V Power(Watts):102.5mW Forward Current:2mA Wavelength - Dominant:525nm Wavelength - Dominant:525nm Peak Wavelength:515nm Lens Color:Water Clear Luminous Intensity:420mc; Supplier Part: C5569567; Manufacturer: Kingbright; Supplier Footprint: 0603; JLCPCB Part Class: Extended Part; Datasheet: https://item.szlcsc.com/datasheet/APTD1608LZGCK/6487941.html; Supplier: LCSC; Illumination Color: Emerald Green; Voltage - Forward(Vf): 2.65V; Power(Watts): 102.5mW; Forward Current: 2mA; Wavelength - Dominant: 525nm; Peak Wavelength: 515nm; Lens Color: Water Clear; Luminous Intensity: 420mcd; Viewing Angle: 60°; Operating Temperature: -40℃~+85℃
LED39 = APT1608LSECK/J3-PRV: Illumination Color:Red Voltage - Forward(Vf):1.8V Voltage - Forward(Vf):1.8V Power(Watts):84mW Forward Current:2mA Wavelength - Dominant:625nm Wavelength - Dominant:625nm Peak Wavelength:640nm Lens Color:Water Clear Luminous Intensity:100mcd Luminous Inte; Supplier Part: C5357909; Manufacturer: Kingbright; Supplier Footprint: 0603; JLCPCB Part Class: Extended Part; Datasheet: https://item.szlcsc.com/datasheet/APT1608LSECK%252FJ3-PRV/6166552.html; Supplier: LCSC; Illumination Color: Red; Voltage - Forward(Vf): 1.8V; Power(Watts): 84mW; Forward Current: 2mA; Wavelength - Dominant: 625nm; Peak Wavelength: 640nm; Lens Color: Water Clear; Luminous Intensity: 100mcd; Viewing Angle: 120°; Operating Temperature: -40℃~+85℃
Q1-Q17 = S8050_C181158: Transistor Type: Collector Current (Ic): Collector-Emitter Breakdown Voltage (Vceo): Power Dissipation (Pd): Transition Frequency (fT):150MHz Collector Cut-Off Current (Icbo):100nA Collector-Emitter Saturation Voltage (VCE(sat)@Ic,Ib):600mV@500mA,50mA Ope; LCSC Part Name: NPN 电流:500mA 耐压:25V H档; Supplier Part: C181158; Manufacturer: Hottech(合科泰); Supplier Footprint: SOT-23; JLCPCB Part Class: Extended Part; Datasheet: https://atta.szlcsc.com/upload/public/pdf/source/20220506/D987F39D56F2975D34EC7947E75C4ABC.pdf; Supplier: LCSC; Transition Frequency (fT): 150MHz; Collector Cut-Off Current (Icbo): 100nA; Collector-Emitter Saturation Voltage (VCE(sat)@Ic,Ib): 600mV@500mA,50mA
R151 R187 = SCR0603F1K: Type:Thick Film Resistors Resistance: Tolerance:±1% Tolerance:±1% Power(Watts): Overload Voltage (Max): Operating Temperature Range:-55℃~+155℃ Operating Temperature Range:-55℃~+155℃; LCSC Part Name: 厚膜电阻 1kΩ ±1% 100mW; Supplier Part: C3016283; Manufacturer: VO(翔胜); Supplier Footprint: 0603; JLCPCB Part Class: Extended Part; Datasheet: https://atta.szlcsc.com/upload/public/pdf/source/20220513/247AF9639BA21CF93567DC289CCC6A22.pdf; Supplier: LCSC; Type: Thick Film Resistors; Tolerance: ±1%; Operating Temperature Range: -55℃~+155℃
R152 = SCR0603J4K7: Type:Thick Film Resistors Resistance: Tolerance:±5% Tolerance:±5% Power(Watts): Overload Voltage (Max): Operating Temperature Range:-55℃~+155℃ Operating Temperature Range:-55℃~+155℃; LCSC Part Name: 厚膜电阻 4.7kΩ ±5% 100mW; Supplier Part: C3017722; Manufacturer: VO(翔胜); Supplier Footprint: 0603; JLCPCB Part Class: Extended Part; Datasheet: https://atta.szlcsc.com/upload/public/pdf/source/20220513/247AF9639BA21CF93567DC289CCC6A22.pdf; Supplier: LCSC; Type: Thick Film Resistors; Tolerance: ±5%; Operating Temperature Range: -55℃~+155℃
R155 = SCR0603J10K: Type:Thick Film Resistors Resistance: Tolerance:±5% Tolerance:±5% Power(Watts): Overload Voltage (Max): Operating Temperature Range:-55℃~+155℃ Operating Temperature Range:-55℃~+155℃; LCSC Part Name: 厚膜电阻 10kΩ ±5% 100mW; Supplier Part: C3017715; Manufacturer: VO(翔胜); Supplier Footprint: 0603; JLCPCB Part Class: Extended Part; Datasheet: https://atta.szlcsc.com/upload/public/pdf/source/20220513/247AF9639BA21CF93567DC289CCC6A22.pdf; Supplier: LCSC; Type: Thick Film Resistors; Tolerance: ±5%; Operating Temperature Range: -55℃~+155℃
R181 = RC0603FR-07390RL: Type:Thick Film Resistors Resistance: Tolerance:±1% Tolerance:±1% Power(Watts): Overload Voltage (Max): Temperature Coefficient:±100ppm/℃ Temperature Coefficient:±100ppm/℃ Operating Temperature Range:-55℃~+155℃ Operating Temperature Range:-55℃~+155℃; LCSC Part Name: 厚膜电阻 390Ω ±1% 100mW; Supplier Part: C114620; Manufacturer: YAGEO(国巨); Supplier Footprint: 0603; JLCPCB Part Class: Extended Part; Datasheet: https://atta.szlcsc.com/upload/public/pdf/source/20180821/C275644_0D56F95EFF785E7D9A1FEF436B37DA78.pdf; Supplier: LCSC; Type: Thick Film Resistors; Tolerance: ±1%; Temperature Coefficient: ±100ppm/℃; Operating Temperature Range: -55℃~+155℃
R182 = 0603WAF8200T5E: Type:Thick Film Resistor Resistance:820Ω Tolerance:±1% Tolerance:±1% Power(Watts):100mW Voltage-Supply(Max):75V Temperature Coefficient:±100ppm/℃ Temperature Coefficient:±100ppm/℃ Operating Temperature:-55℃~+155℃ Operating Temperature:-55℃~+155℃; LCSC Part Name: 820Ω ±1% 100mW 厚膜电阻; Supplier Part: C23253; Manufacturer: UNI-ROYAL(厚声); Supplier Footprint: 0603; JLCPCB Part Class: Basic Part; Datasheet: https://item.szlcsc.com/datasheet/0603WAF8200T5E/23980.html; Supplier: LCSC; Type: Thick Film Resistor; Tolerance: ±1%; Power(Watts): 100mW; Voltage-Supply(Max): 75V; Temperature Coefficient: ±100ppm/℃; Operating Temperature: -55℃~+155℃
R183 = FRC0603F1201TS: Type:Thick Film Resistor Resistance:1.2kΩ Tolerance:±1% Tolerance:±1% Power(Watts):100mW Voltage-Supply(Max):75V Temperature Coefficient:±100ppm/℃ Temperature Coefficient:±100ppm/℃ Operating Temperature:-55℃~+155℃ Operating Temperature:-55℃~+155℃; LCSC Part Name: 1.2kΩ ±1% 100mW 厚膜电阻; Supplier Part: C2906976; Manufacturer: FOJAN(富捷); Supplier Footprint: 0603; JLCPCB Part Class: Extended Part; Supplier: LCSC; Type: Thick Film Resistor; Tolerance: ±1%; Power(Watts): 100mW; Voltage-Supply(Max): 75V; Temperature Coefficient: ±100ppm/℃; Operating Temperature: -55℃~+155℃
R184 R185 = FRC0603F5101TS: Type:Thick Film Resistor Resistance:5.1kΩ Tolerance:±1% Tolerance:±1% Power(Watts):100mW Voltage-Supply(Max):75V Temperature Coefficient:±100ppm/℃ Temperature Coefficient:±100ppm/℃ Operating Temperature:-55℃~+155℃ Operating Temperature:-55℃~+155℃; LCSC Part Name: 5.1kΩ ±1% 100mW 厚膜电阻; Supplier Part: C2907044; Manufacturer: FOJAN(富捷); Supplier Footprint: 0603; JLCPCB Part Class: Extended Part; Datasheet: https://item.szlcsc.com/datasheet/FRC0603F5101TS/3180557.html; Supplier: LCSC; Type: Thick Film Resistor; Tolerance: ±1%; Power(Watts): 100mW; Voltage-Supply(Max): 75V; Temperature Coefficient: ±100ppm/℃; Operating Temperature: -55℃~+155℃
R186 = SCR0603J1M: Type:Thick Film Resistor Resistance:1MΩ Tolerance:±5% Tolerance:±5% Power(Watts):100mW Voltage-Supply(Max):75V Operating Temperature:-55℃~+155℃ Operating Temperature:-55℃~+155℃; LCSC Part Name: 厚膜电阻 1MΩ ±5% 100mW; Supplier Part: C3017671; Manufacturer: VO(翔胜); Supplier Footprint: 0603; JLCPCB Part Class: Extended Part; Datasheet: https://atta.szlcsc.com/upload/public/pdf/source/20220513/247AF9639BA21CF93567DC289CCC6A22.pdf; Supplier: LCSC; Type: Thick Film Resistor; Tolerance: ±5%; Power(Watts): 100mW; Voltage-Supply(Max): 75V; Operating Temperature: -55℃~+155℃
R188 = 0603WAJ0331T5E: Type:Thick Film Resistor Resistance:330Ω Tolerance:±5% Tolerance:±5% Power(Watts):100mW Voltage-Supply(Max):75V Temperature Coefficient:±100ppm/℃ Temperature Coefficient:±100ppm/℃ Operating Temperature:-55℃~+155℃ Operating Temperature:-55℃~+155℃; LCSC Part Name: 330Ω ±5% 100mW 厚膜电阻; Supplier Part: C25231; Manufacturer: UNI-ROYAL(厚声); Supplier Footprint: 0603; JLCPCB Part Class: Extended Part; Datasheet: https://item.szlcsc.com/datasheet/0603WAJ0331T5E/25974.html; Supplier: LCSC; Type: Thick Film Resistor; Tolerance: ±5%; Power(Watts): 100mW; Voltage-Supply(Max): 75V; Temperature Coefficient: ±100ppm/℃; Operating Temperature: -55℃~+155℃
SCREW1-SCREW4 = Screw-Hole-M4: Supplier Footprint: 插件
SW1 = 1TS005F-2500-5001_C255812: Circuit:SPST Actuator Style:Round Button Operating Force:2.5N Mounting Type:Surface Mount,Vertical Length:6mm Width:6mm Switch Height:5mm with Bracket:Without Bracket Contact Current:50mA Voltage Rating:12V Actuator/Cap Color:Black With Lamp:No Terminatio; LCSC Part Name: 6*6*5mm 立贴 轻触开关; Supplier Part: C255812; Manufacturer: HYP(鸿源精密); Supplier Footprint: SMD-4P,6x6mm; JLCPCB Part Class: Extended Part; Datasheet: https://item.szlcsc.com/datasheet/1TS005F-2500-5001/249855.html; Supplier: LCSC; Circuit: SPST; Actuator Style: Round Button; Operating Force: 2.5N; Mounting Type: Surface Mount,Vertical; Length: 6mm; Width: 6mm; Switch Height: 5mm; with Bracket: Without Bracket; Contact Current: 50mA; Voltage Rating: 12V; Actuator/Cap Color: Black; With Lamp: No; Termination Style: Gull Wing; Life: 70,000 Cycles; Operating Temperature: -40℃~+90℃
TP1 = Test-Point: Test Point 测试点; Check: false
U3 = ESP32-S3-WROOM-1-N8R8: Supplier Part: C2913201; Manufacturer: ESPRESSIF(乐鑫); Supplier Footprint: SMD,25.5x18mm; JLCPCB Part Class: Extended Part; Datasheet: https://item.szlcsc.com/datasheet/ESP32-S3-WROOM-1-N8R8/3198299.html; Supplier: LCSC
U10 = ADES1830CCSZ: Supplier Part: C22463734; Manufacturer: ADI(亚德诺); Supplier Footprint: LFCSP-72(10x10); JLCPCB Part Class: Extended Part; Datasheet: https://atta.szlcsc.com/upload/public/pdf/source/20250619/0000A5D83CF05E2F9EC661EE1E06E61D.pdf; Supplier: LCSC
U12 = AMS1117-3.3_C347222: Output Type:Fixed Voltage - Supply:12V Output Voltage:3.3V Output Voltage:3.3V Output Current:1A Power Supply Rejection Ratio (PSRR):60dB@(120Hz) Voltage Dropout:1.3V@(1A) standby current:- Noise:- Features:Overcurrent Protection Operating Temperature:- O; LCSC Part Name: 输出:3.3V 电流:1A 耐压:12V; Supplier Part: C347222; Manufacturer: UMW(友台半导体); Supplier Footprint: SOT-223; JLCPCB Part Class: Extended Part; Datasheet: https://item.szlcsc.com/datasheet/AMS1117-3.3/323882.html; Supplier: LCSC; Output Type: Fixed; Voltage - Supply: 12V; Output Voltage: 3.3V; Output Current: 1A; Power Supply Rejection Ratio (PSRR): 60dB@(120Hz); Voltage Dropout: 1.3V@(1A); Features: Overcurrent Protection; Output Configuration: Positive electrode; Number of Outputs: 1
U14 U15 = MX15EDGRM-3.5-10P-GN01-Cu-A: Connector Type:Receptacle-Close fixed form:Screw Fixing Structure:1x10P Pitch:3.5mm Color:Green Mounting Style:Bend Number of Pins:10P Number of Rows:1 Number of PINs Per Row:10 Current Rating (Max):8A Voltage Rating (Max):300V Operating Temperature Range; LCSC Part Name: 螺丝固定 1x10P 3.5mm 排数:1 每排P数:10; Supplier Part: C5188349; Manufacturer: MAX(迈旭); Supplier Footprint: 弯插,P=3.5mm; JLCPCB Part Class: Extended Part; Datasheet: https://atta.szlcsc.com/upload/public/pdf/source/20230914/88F81637A84810C01DEF4CBC9CB88FF8.pdf; Supplier: LCSC; Connector Type: Receptacle-Close; fixed form: Screw Fixing; Structure: 1x10P; Pitch: 3.5mm; Color: Green; Mounting Style: Bend; Number of Pins: 10P; Number of Rows: 1; Number of PINs Per Row: 10; Current Rating (Max): 8A; Voltage Rating (Max): 300V; Operating Temperature Range: -40℃~+105℃
U16 = LM2596HVS-5.0/TR: Function:Step-down type Output Type:Fixed Voltage - Supply:5V~60V Voltage - Supply:5V~60V Output Voltage:5V Output Voltage:5V Output Current:3A Frequency - Switching:150kHz Frequency - Switching:150kHz Operating Temperature:-40℃~+125℃ Operating Temperatur; LCSC Part Name: 3A 150KHz DC 开关稳压电路; Supplier Part: C7421039; Manufacturer: HGSEMI(华冠); Supplier Footprint: TO-263-5; JLCPCB Part Class: Extended Part; Datasheet: https://atta.szlcsc.com/upload/public/pdf/source/20230608/50F81A07F1CB4120FC66F79925E72406.pdf; Supplier: LCSC; Function: Step-down type; Output Type: Fixed; Voltage - Supply: 5V~60V; Output Voltage: 5V; Output Current: 3A; Frequency - Switching: 150kHz; Operating Temperature: -40℃~+125℃; Synchronous Rectifier: No; Number of Outputs: 1; Topology: Step-down; Quiescent Current: 3.6mA; Switch tube (built-in/external): Built-in
USB2 = USB_TYPE-C-16P: Supplier Footprint: Through
R47 R51 R52 R55 R59 R63 R67 R71 R75 R79 R83 R87 R91 R95 R99 R103 R107 R156 = PTFR0603B200RN9: Type:Thin Film Resistor Resistance:200Ω Tolerance:±0.1% Tolerance:±0.1% Power(Watts):100mW Voltage-Supply(Max):100V Temperature Coefficient:±10ppm/℃ Temperature Coefficient:±10ppm/℃ Operating Temperature:-55℃~+125℃ Operating Temperature:-55℃~+125℃; LCSC Part Name: 薄膜电阻 200Ω ±0.1% 100mW; Supplier Part: C394542; Manufacturer: RESI(开步睿思); Supplier Footprint: 0603; JLCPCB Part Class: Extended Part; Datasheet: https://atta.szlcsc.com/upload/public/pdf/source/20240506/11BDC7478D84177AC2A5326A65B6EB29.pdf; Supplier: LCSC; Type: Thin Film Resistor; Tolerance: ±0.1%; Power(Watts): 100mW; Voltage-Supply(Max): 100V; Temperature Coefficient: ±10ppm/℃; Operating Temperature: -55℃~+125℃
R49 R50 R53 R54 R57 R58 R61 R62 R65 R66 R69 R70 R73 R74 R77 R78 R81 R82 R85 R86 R89 R90 R93 R94 R97 R98 R101 R102 R105 R106 R109 R110 = FRP2512J100 TS: Type:Thick Film Resistor Resistance:10Ω Tolerance:±5% Tolerance:±5% Power(Watts):2W Voltage-Supply(Max):200V Temperature Coefficient:±200ppm/℃ Temperature Coefficient:±200ppm/℃; LCSC Part Name: 10Ω ±5% 2W 厚膜电阻; Supplier Part: C3013385; Manufacturer: FOJAN(富捷); Supplier Footprint: 2512; JLCPCB Part Class: Extended Part; Datasheet: https://item.szlcsc.com/datasheet/FRP2512J100%2520TS/3519669.html; Supplier: LCSC; Type: Thick Film Resistor; Tolerance: ±5%; Power(Watts): 2W; Voltage-Supply(Max): 200V; Temperature Coefficient: ±200ppm/℃
LED13-LED28 = NCD0805G1: Lamp Holder Type:- Illumination Color:Green Voltage - Forward(Vf):2.5V~3.6V Voltage - Forward(Vf):2.5V~3.6V Power(Watts):72mW Forward Current:20mA Wavelength - Dominant:525nm~537.5nm Wavelength - Dominant:525nm~537.5nm Peak Wavelength:520nm Diode Configur; LCSC Part Name: 片式发光二极管; Supplier Part: C84260; Manufacturer: 国星光电; Supplier Footprint: 0805; JLCPCB Part Class: Extended Part; Datasheet: https://item.szlcsc.com/datasheet/NCD0805G1/85429.html; Supplier: LCSC; Illumination Color: Green; Voltage - Forward(Vf): 2.5V~3.6V; Power(Watts): 72mW; Forward Current: 20mA; Wavelength - Dominant: 525nm~537.5nm; Peak Wavelength: 520nm; Luminous Intensity: 400mcd; Viewing Angle: 130°; Operating Temperature: -30℃~+85℃
R118 R120 R122 R124 R126 R128 R130 R132 R134 R136 R138 R140 R142 R144 R146 R148 = PTFR0603B68R0P9: Type:Thin Film Resistor Resistance:68Ω Tolerance:±0.1% Tolerance:±0.1% Power(Watts):100mW Voltage-Supply(Max):100V Temperature Coefficient:±25ppm/℃ Temperature Coefficient:±25ppm/℃ Operating Temperature:-55℃~+125℃ Operating Temperature:-55℃~+125℃; LCSC Part Name: 薄膜电阻 68Ω ±0.1% 100mW; Supplier Part: C351632; Manufacturer: RESI(开步睿思); Supplier Footprint: 0603; JLCPCB Part Class: Extended Part; Datasheet: https://atta.szlcsc.com/upload/public/pdf/source/20240506/11BDC7478D84177AC2A5326A65B6EB29.pdf; Supplier: LCSC; Type: Thin Film Resistor; Tolerance: ±0.1%; Power(Watts): 100mW; Voltage-Supply(Max): 100V; Temperature Coefficient: ±25ppm/℃; Operating Temperature: -55℃~+125℃
R119 R121 R123 R125 R127 R129 R131 R133 R135 R137 R139 R141 R143 R145 R147 R149 = 0603WAJ0102T5E: Type:Thick Film Resistor Resistance:1kΩ Tolerance:±5% Tolerance:±5% Power(Watts):100mW Voltage-Supply(Max):75V Temperature Coefficient:±100ppm/℃ Temperature Coefficient:±100ppm/℃ Operating Temperature:-55℃~+155℃ Operating Temperature:-55℃~+155℃; LCSC Part Name: 1kΩ ±5% 100mW 厚膜电阻; Supplier Part: C25585; Manufacturer: UNI-ROYAL(厚声); Supplier Footprint: 0603; JLCPCB Part Class: Extended Part; Datasheet: https://item.szlcsc.com/datasheet/0603WAJ0102T5E/26328.html; Supplier: LCSC; Type: Thick Film Resistor; Tolerance: ±5%; Power(Watts): 100mW; Voltage-Supply(Max): 75V; Temperature Coefficient: ±100ppm/℃; Operating Temperature: -55℃~+155℃

## Nets
+5V: C61.2 C64.2 C75.1 D4.1(-) H9.3 L1.2 R183.2 U12.3(VIN) U16.4(FEEDBACK)
GND: C8.2 C54.2 C61.1 C62.1 C63.1 C64.1 C65.1 C66.1 C67.1 C68.1 C69.1 C70.2 C72.1 C73.1 C74.1 C75.2 CN1.3 CN2.3 CN3.3 CN4.3 CN5.3 D2.2(A) H2.2 H7.6 LED40.1(C) Q1.2 R52.1 R54.1 R184.1 R185.1 R186.1 SW1.3 U3.1(GND) U3.40(GND) U3.41(GND) U10.53(ISOMD) U10.60(V-) U10.73(V-) U12.1(ADJ(GND)) U14.1 U16.3(GND) U16.5(ON_OFF) U16.6(GND) USB2.A1(GND) USB2.A12(GND) USB2.B1(GND) USB2.B12(GND)
VBUS: D3.4 D4.2(+) USB2.A4(VBUS) USB2.A9(VBUS) USB2.B4(VBUS) USB2.B9(VBUS)
VCC: C54.1 C62.2 C66.2 CN1.2 CN2.2 CN3.2 CN4.2 H7.1 R151.2 R152.2 R155.2 R181.2 R182.2 U3.2(3V3) U12.2(VOUT(TAB)) U12.4(TAB)
ACT_BAL_EN: U3.10(IO17) U15.9
ACT_BAL_PWM: U3.11(IO18) U15.10
B1+: Q2.2 R50.1 R51.1 R53.1 R118.2 U14.2
B2+: Q3.2 R47.1 R49.1 R62.1 R120.2 U14.3
B3+: Q4.2 R58.1 R59.1 R61.1 R122.2 U14.4
B4+: Q5.2 R55.1 R57.1 R70.1 R124.2 U14.5
B5+: Q6.2 R66.1 R67.1 R69.1 R126.2 U14.6
B6+: Q7.2 R63.1 R65.1 R78.1 R128.2 U14.7
B7+: Q8.2 R74.1 R75.1 R77.1 R130.2 R156.1 U14.8
B8+: Q9.2 R71.1 R73.1 R86.1 R132.2 U14.9
B9+: Q10.2 R82.1 R83.1 R85.1 R134.2 U15.1
B10+: Q11.2 R79.1 R81.1 R94.1 R136.2 U15.2
B11+: Q12.2 R90.1 R91.1 R93.1 R138.2 U15.3
B12+: Q13.2 R87.1 R89.1 R102.1 R140.2 U15.4
B13+: Q14.2 R98.1 R99.1 R101.1 R142.2 U15.5
B14+: Q15.2 R95.1 R97.1 R110.1 R144.2 U15.6
B15+: Q16.2 R106.1 R107.1 R109.1 R146.2 U15.7
B16+: C8.1 C63.2 CN5.1 R103.1 R105.1 R148.2 R187.2 R188.1 U15.8 U16.1(VIN)
C0: C20.1 R52.2 U10.50(C0)
C1: C18.1 C20.2 R51.2 U10.48(C1)
C2: C18.2 C24.1 R47.2 U10.45(C2)
C3: C22.1 C24.2 R59.2 U10.42(C3)
C4: C22.2 C28.1 R55.2 U10.39(C4)
C5: C26.1 C28.2 R67.2 U10.36(C5)
C6: C26.2 C36.1 R63.2 U10.33(C6)
C7: C34.1 C36.2 R75.2 U10.30(C7)
C8: C34.2 C40.1 C57.1 R71.2 U10.27(C8)
C9: C38.1 C40.2 R83.2 U10.23(C9)
C9N: C57.2 R156.2 U10.26(C9N)
C10: C38.2 C44.1 R79.2 U10.20(C10)
C11: C42.1 C44.2 R91.2 U10.17(C10)
C12: C42.2 C48.1 R87.2 U10.14(C12)
C13: C46.1 C48.2 R99.2 U10.11(C13)
C14: C46.2 C52.1 R95.2 U10.8(C14)
C15: C50.1 C52.2 R107.2 U10.5(C15)
C16: C50.2 R103.2 U10.2(C16)
CS: U3.9(IO16) U10.51(CSB(IMA))
DRIVE: Q17.1 TP1.1 U10.58(DRIVE)
DRIVE_VREG: H9.1 Q17.2
EN: C67.2 H7.2 R155.1 SW1.2 U3.3(EN)
IO0: H2.1 H7.3 U3.27(IO0)
IO10: H4.1 U3.18(IO10)
IO11: H4.2 U3.19(IO11)
IO12: H4.3 U3.20(IO12)
IO13: H4.4 U3.21(IO13)
IO35: H5.1 U3.28(IO35)
IO36: H5.2 U3.29(IO36)
IO37: H5.3 U3.30(IO37)
IO38: H5.4 U3.31(IO38)
LED_ERR: LED39.1(K) U3.4(IO4)
LED_USR: LED38.1(C) U3.22(IO14)
MISO: R151.1 U3.8(IO15) U10.57(SDO)
MOSI: U3.7(IO7) U10.54(SDI)
RXD: H7.4 U3.36(RXD0)
S1N: C21.1 R54.2 U10.59(SIN)
S1P: C21.2 R53.2 R119.2 U10.49(S1P)
S2N: C19.1 R50.2 U10.46(S2N)
S2P: C19.2 R49.2 R121.2 U10.47(S2P)
S3N: C25.1 R62.2 U10.43(S3N)
S3P: C25.2 R61.2 R123.2 U10.44(S3P)
S4N: C23.1 R58.2 U10.40(S4N)
S4P: C23.2 R57.2 R125.2 U10.41(S4P)
S5N: C29.1 R70.2 U10.37(S5N)
S5P: C29.2 R69.2 R127.2 U10.38(S5P)
S6N: C27.1 R66.2 U10.34(S6N)
S6P: C27.2 R65.2 R129.2 U10.35(S6P)
S7N: C37.1 R78.2 U10.31(S7N)
S7P: C37.2 R77.2 R131.2 U10.32(S7P)
S8N: C35.1 R74.2 U10.28(S8N)
S8P: C35.2 R73.2 R133.2 U10.29(S8P)
S9N: C41.1 R86.2 U10.24(S9N)
S9P: C41.2 R85.2 R135.2 U10.25(S9P)
S10N: C39.1 R82.2 U10.21(S10N)
S10P: C39.2 R81.2 R137.2 U10.22(S10P)
S11N: C45.1 R94.2 U10.18(S11N)
S11P: C45.2 R93.2 R139.2 U10.19(S11P)
S12N: C43.1 R90.2 U10.15(S12N)
S12P: C43.2 R89.2 R141.2 U10.16(S12P)
S13N: C49.1 R102.2 U10.13(S13N)
S13P: C49.2 R101.2 R143.2 U10.12(S13P)
S14N: C47.1 R98.2 U10.9(S14N)
S14P: C47.2 R97.2 R145.2 U10.10(S14P)
S15N: C53.1 R110.2 U10.6(S15N)
S15P: C53.2 R109.2 R147.2 U10.7(S15P)
S16N: C51.1 R106.2 U10.3(S16N)
S16P: C51.2 R105.2 R149.2 U10.4(S16P)
SCLK: U3.6(IO6) U10.52(SCK(IPA))
TEMP_1WIRE: CN1.1 CN2.1 CN3.1 CN4.1 R152.1 U3.17(IO9)
TXD: H7.5 U3.37(TXD0)
USB_D+: D3.3 U3.14(IO20) USB2.A6(DP1) USB2.B6(DP2)
USB_D-: D3.2 U3.13(IO19) USB2.A7(DN1) USB2.B7(DN2)
USB_SH: C70.1 D3.1 R186.2 USB2.2(EP)
V+: C72.2 R187.1 U10.1(V+)
VREG: C74.2 H9.2 U10.62(VREG)
$1N1698: D2.1(K) L1.1 U16.2(OUTPUT)
$1N8969: C65.2 SW1.1
$1N10613: C68.2 U10.63(VREF1)
$1N10728: C69.2 U10.61(VREF2)
$1N25488: LED38.2(A) R181.1
$1N25489: LED39.2(A) R182.1
$1N25601: LED40.2(A) R183.1
$1N27362: R184.2 USB2.A5(CC1)
$1N27394: R185.2 USB2.B5(CC2)
$1N37570: C73.2 Q17.3 R188.2
$3N538: Q1.1 R119.1
$3N540: LED13.2(K) Q1.3
$3N542: LED13.1(A) R118.1
$3N550: Q2.1 R121.1
$3N552: LED14.2(K) Q2.3
$3N554: LED14.1(A) R120.1
$3N562: Q3.1 R123.1
$3N564: LED15.2(K) Q3.3
$3N566: LED15.1(A) R122.1
$3N1234: Q4.1 R125.1
$3N1236: LED16.2(K) Q4.3
$3N1238: LED16.1(A) R124.1
$3N1246: Q5.1 R127.1
$3N1248: LED17.2(K) Q5.3
$3N1250: LED17.1(A) R126.1
$3N1576: Q6.1 R129.1
$3N1578: LED18.2(K) Q6.3
$3N1580: LED18.1(A) R128.1
$3N1588: Q7.1 R131.1
$3N1590: LED19.2(K) Q7.3
$3N1592: LED19.1(A) R130.1
$3N2713: Q8.1 R133.1
$3N2715: LED20.2(K) Q8.3
$3N2717: LED20.1(A) R132.1
$3N2725: Q9.1 R135.1
$3N2727: LED21.2(K) Q9.3
$3N2729: LED21.1(A) R134.1
$3N2737: Q10.1 R137.1
$3N2739: LED22.2(K) Q10.3
$3N2741: LED22.1(A) R136.1
$3N2749: Q11.1 R139.1
$3N2751: LED23.2(K) Q11.3
$3N2753: LED23.1(A) R138.1
$3N2761: Q12.1 R141.1
$3N2763: LED24.2(K) Q12.3
$3N2765: LED24.1(A) R140.1
$3N2773: Q13.1 R143.1
$3N2775: LED25.2(K) Q13.3
$3N2777: LED25.1(A) R142.1
$3N2785: Q14.1 R145.1
$3N2787: LED26.2(K) Q14.3
$3N2789: LED26.1(A) R144.1
$3N3115: Q15.1 R147.1
$3N3117: LED27.2(K) Q15.3
$3N3119: LED27.1(A) R146.1
$3N3127: Q16.1 R149.1
$3N3129: LED28.2(K) Q16.3
$3N3131: LED28.1(A) R148.1

Not connected (* = marked no-connect by the designer): CN5 2; SCREW1 1; SCREW2 1; SCREW3 1; SCREW4 1; SW1 4; U3 5(IO5) 12(IO8) 15(IO3) 16(IO46) 23(IO21) 24(IO47) 25(IO48) 26(IO45) 32(IO39) 33(IO40) 34(IO41) 35(IO42) 38(IO2) 39(IO1); U10 55(IMB) 56(IPB) 64(GPIO9) 65(GPIO8) 66(GPIO7) 67(GPIO6) 68(GPIO5) 69(GPIO4) 70(GPIO3) 71(GPIO2) 72(GPIO1); U14 10; USB2 1(EP) 3(EP) 4(EP) A8(SUB1) B8(SUB2)

## Notes on the sheets
sheet 1
- Power supply
- ESP32-S3
- Temperature Sens
- ESP32 has 4 strapping pins!
   - GPIO0   : internal pull-up
   - GPIO3   : floating
   - GPIO45 : internal pull-down
   - GPIO46 : internal pull-down
  ADC1: GPIO1,2,3,4,5,6,7,8,9,10
  ADC2 is used by wifi
- Cell manager
- UART
- ISOMD pulled low,
  enables 4-Wire SPI mode.
- USB
- Reboot
sheet 2
- BAT1
- BAT2
- BAT3
- BAT4
- BAT5
- BAT6
- ADC
- ADC
- ADC
- ADC
- ADC
- ADC
- BAL
- BAL
- BAL
- BAL
- BAL
- BAL
- BAT7
- BAT8
- BAT9
- BAT10
- BAT11
- BAT12
- ADC
- ADC
- ADC
- ADC
- ADC
- ADC
- BAL
- BAL
- BAL
- BAL
- BAL
- BAL
- BAT13
- BAT14
- BAT15
- BAT16
- BUSBAR BYPASS
- ADC
- ADC
- ADC
- ADC
- BAL
- BAL
- BAL
- BAL
